# Altium schematic sheet NewPowerandPlaceSCH.SchDoc
size A0
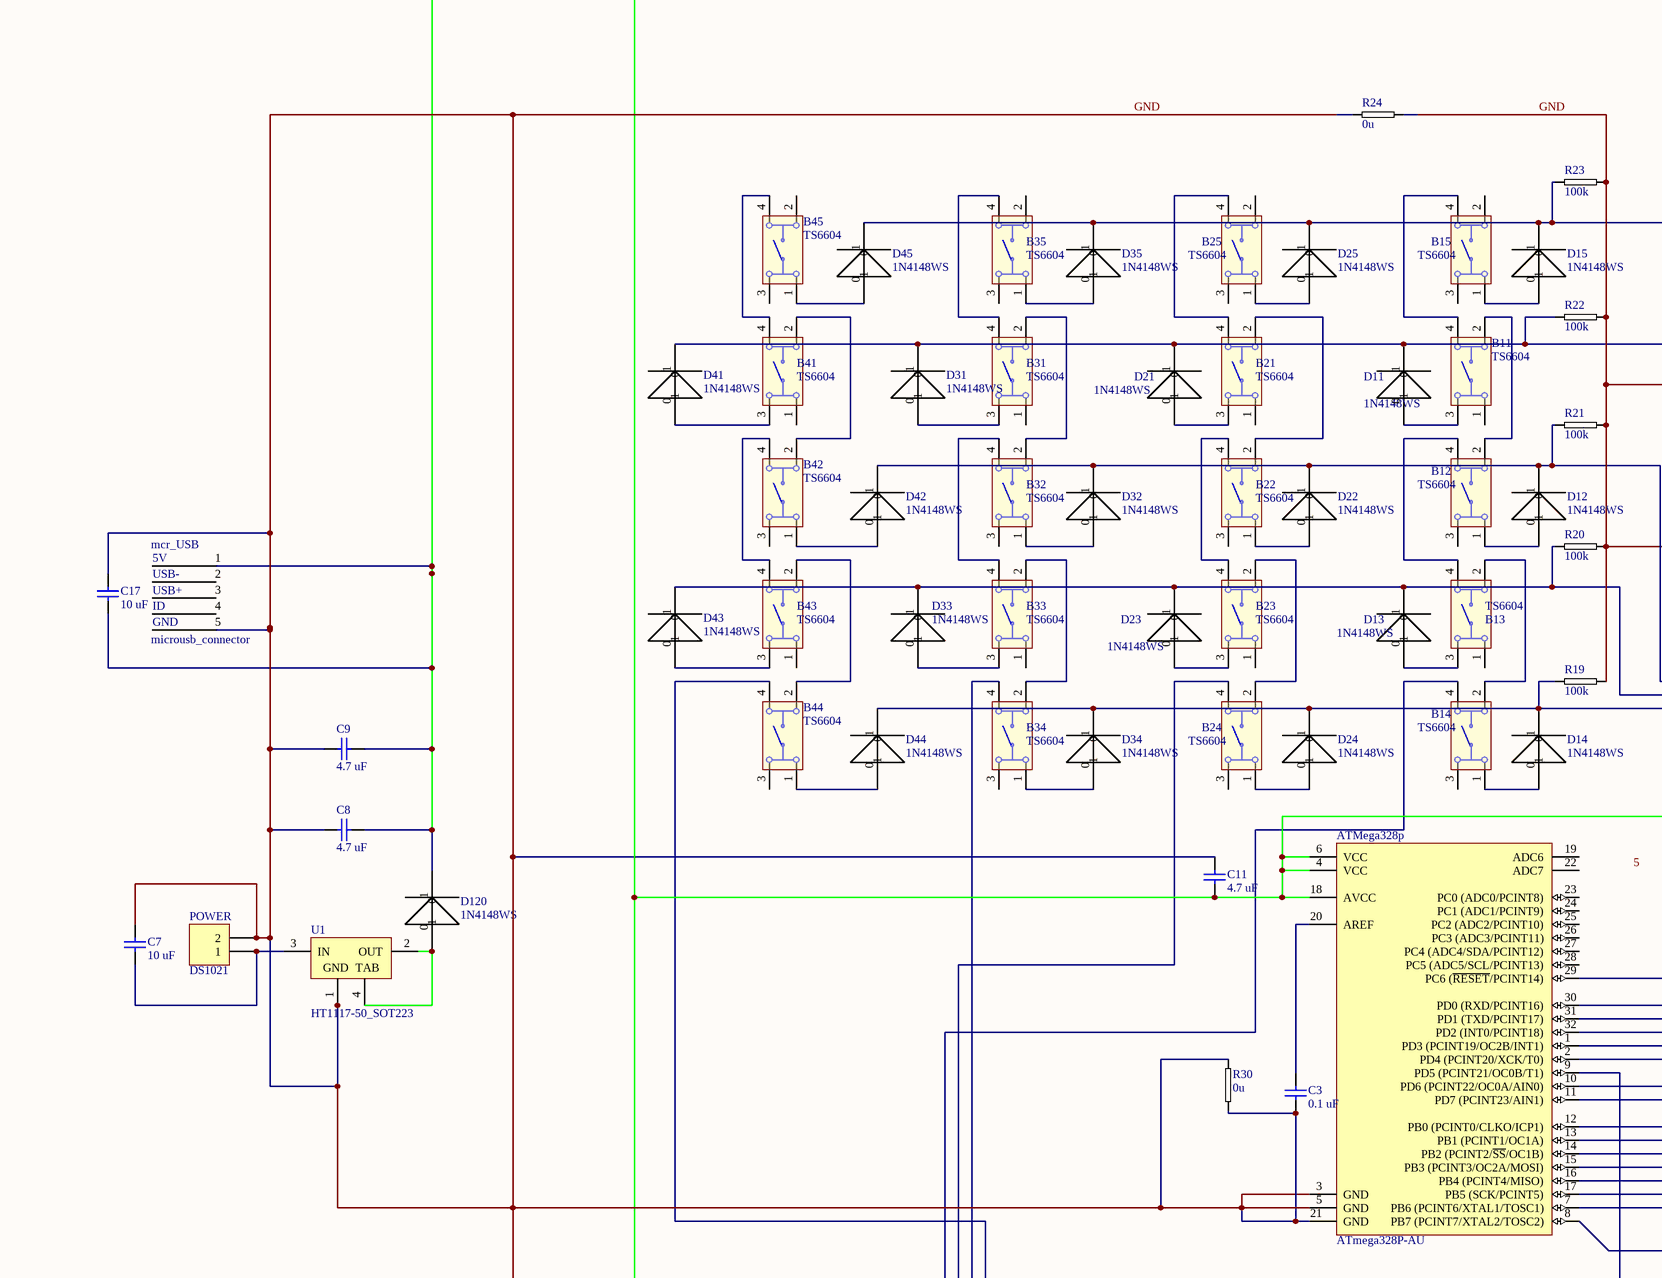
[diagram p0: NewPowerandPlaceSCH.SchDoc, top left]
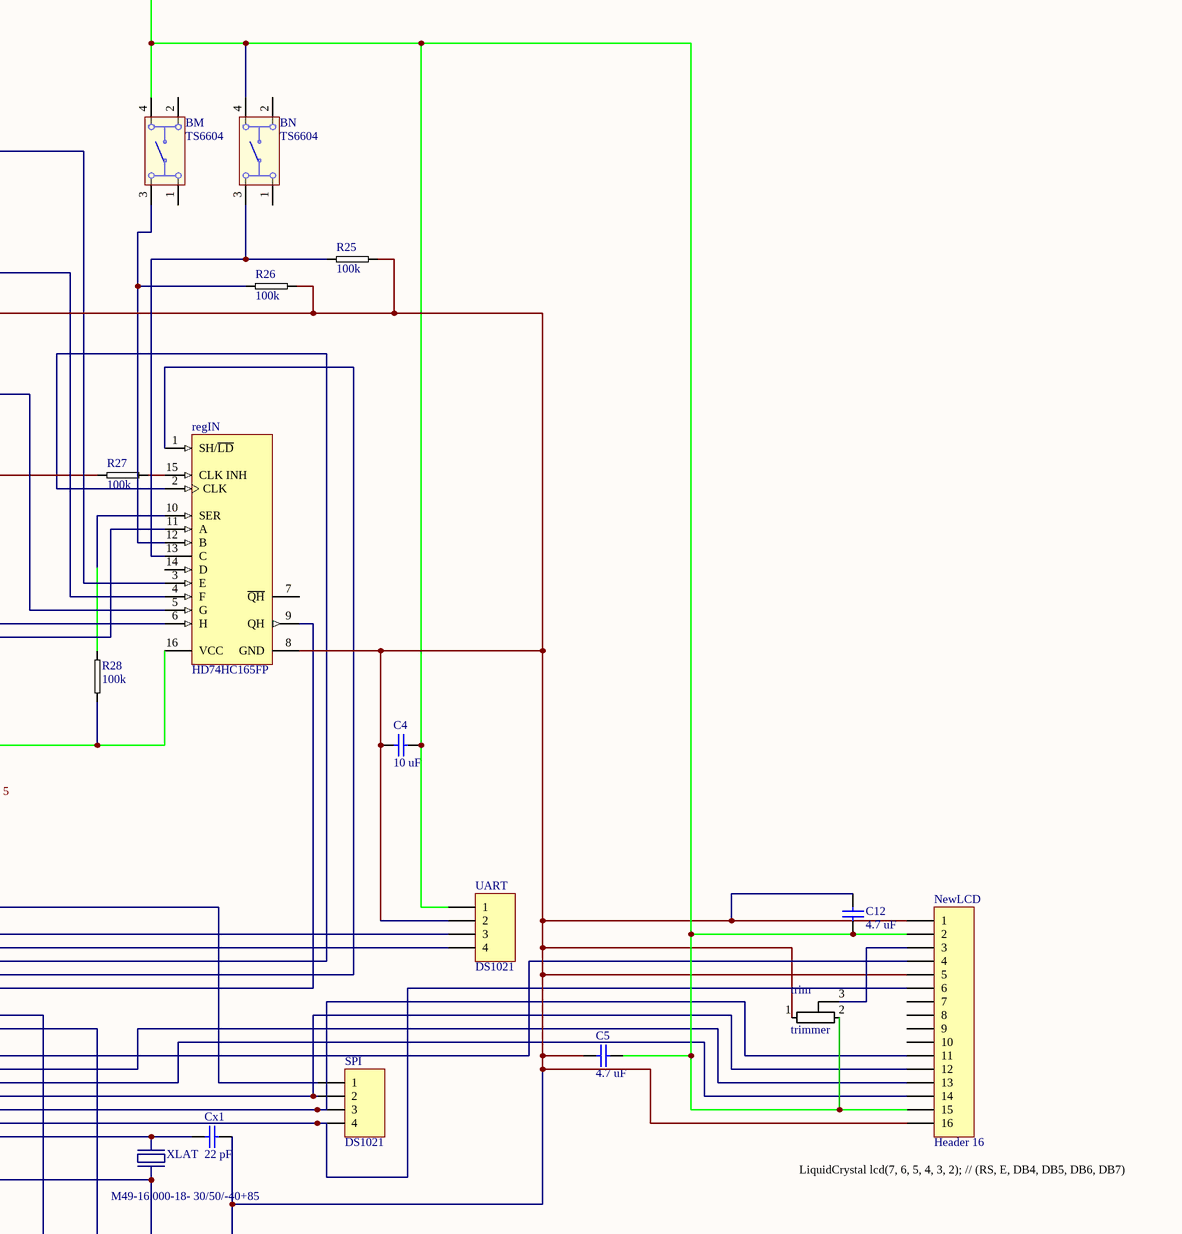
[diagram p1: NewPowerandPlaceSCH.SchDoc, top right]
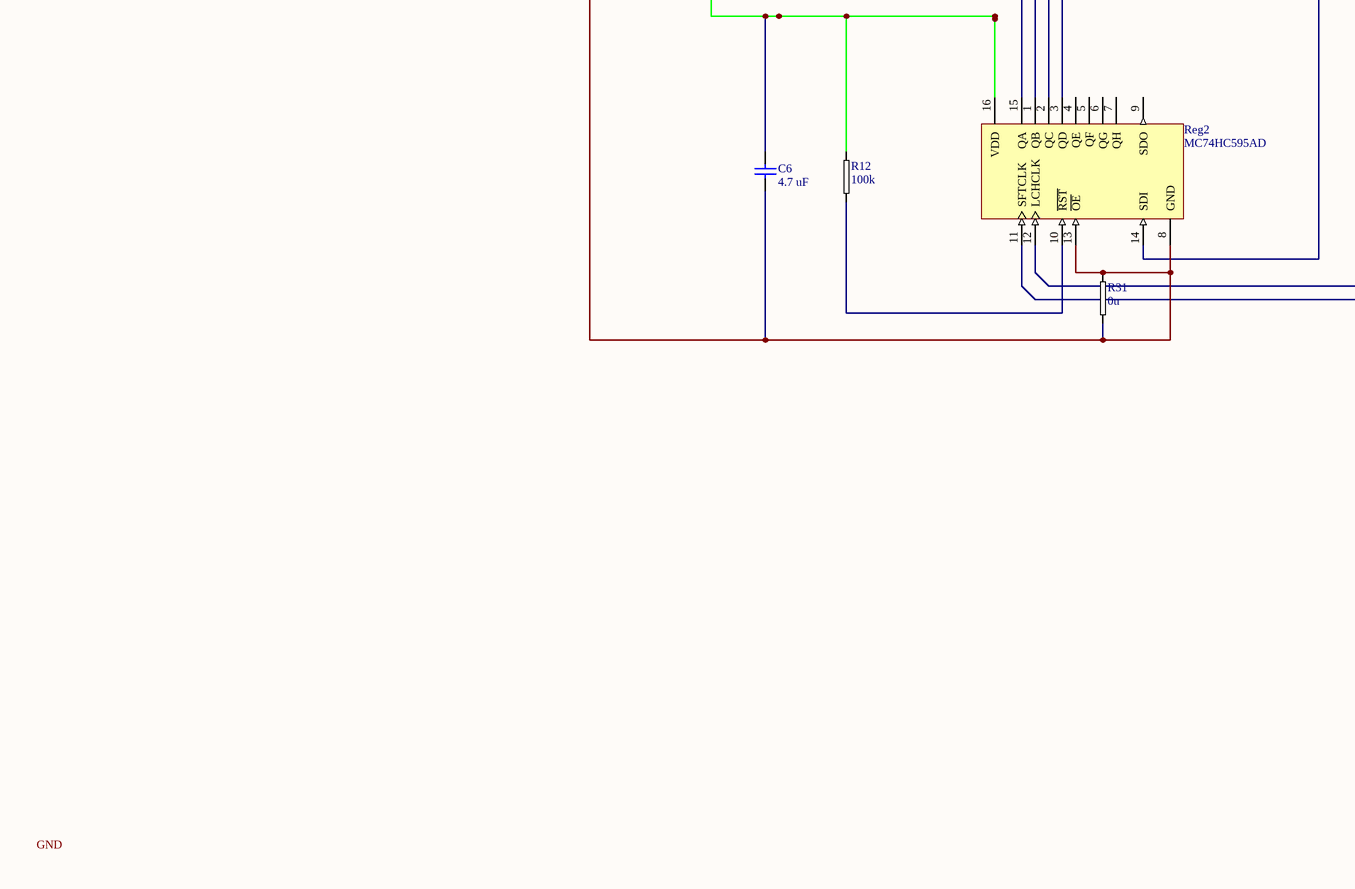
[diagram p2: NewPowerandPlaceSCH.SchDoc, bottom left]
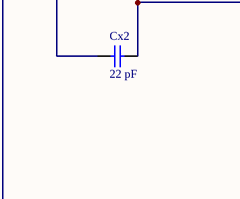
[diagram p3: NewPowerandPlaceSCH.SchDoc, bottom right]

## Parts
ATMega328p  ATmega328P-AU  [32A_N]
B11  TS6604  [430182070816]
B12  TS6604  [430182070816]
B13  TS6604  [430182070816]
B14  TS6604  [430182070816]
B15  TS6604  [430182070816]
B21  TS6604  [430182070816]
B22  TS6604  [430182070816]
B23  TS6604  [430182070816]
B24  TS6604  [430182070816]
B25  TS6604  [430182070816]
B31  TS6604  [430182070816]
B32  TS6604  [430182070816]
B33  TS6604  [430182070816]
B34  TS6604  [430182070816]
B35  TS6604  [430182070816]
B41  TS6604  [430182070816]
B42  TS6604  [430182070816]
B43  TS6604  [430182070816]
B44  TS6604  [430182070816]
B45  TS6604  [430182070816]
BM  TS6604  [430182070816]
BN  TS6604  [430182070816]
C3  0.1 uF  [0805]
C11  4.7 uF  [0805]
C12  4.7 uF  [0805]
C17  10 uF  [0805]
D11  1N4148WS  [sod323]
D12  1N4148WS  [sod323]
D13  1N4148WS  [sod323]
D14  1N4148WS  [sod323]
D15  1N4148WS  [sod323]
D21  1N4148WS  [sod323]
D22  1N4148WS  [sod323]
D23  1N4148WS  [sod323]
D24  1N4148WS  [sod323]
D25  1N4148WS  [sod323]
D31  1N4148WS  [sod323]
D32  1N4148WS  [sod323]
D33  1N4148WS  [sod323]
D34  1N4148WS  [sod323]
D35  1N4148WS  [sod323]
D41  1N4148WS  [sod323]
D42  1N4148WS  [sod323]
D43  1N4148WS  [sod323]
D44  1N4148WS  [sod323]
D45  1N4148WS  [sod323]
D120  1N4148WS  [sod323]
mcr_USB  microusb_connector  [USB_connector_2]
NewLCD  Header 16  [HDR1X16]
POWER  DS1021  [HDR1X2]
R12  100k  [res_0805]
R19  100k  [res_0805]
R20  100k  [res_0805]
R21  100k  [res_0805]
R22  100k  [res_0805]
R23  100k  [res_0805]
R24  0u  [res_0805]
R25  100k  [res_0805]
R26  100k  [res_0805]
R27  100k  [res_0805]
R28  100k  [res_0805]
R30  0u  [res_0805]
R31  0u  [res_0805]
Reg2  MC74HC595AD  [751B-05_N]
regIN  HD74HC165FP  [PRSP0016DH-B_N]
SPI  DS1021  [HDR1X4]
trim  trimmer  [trimmer_place]
U1  HT1117-50_SOT223  [SOT223_N]
UART  DS1021  [HDR1X4]
XLAT  M49-16.000-18- 30/50/-40+85  [cristal]
С4  10 uF  [0805]
С5  4.7 uF  [0805]
С6  4.7 uF  [0805]
С7  10 uF  [0805]
С8  4.7 uF  [0805]
С9  4.7 uF  [0805]
Сx1  22 pF  [res_0805]
Сx2  22 pF  [res_0805]

## Nets
GND: ATMega328p.3(GND) ATMega328p.5(GND) ATMega328p.21(GND) C3.2 C11.1 C12.2 C17.1 mcr_USB.5 NewLCD.1 NewLCD.5 NewLCD.16 POWER.2 R19.1 R20.1 R21.1 R22.1 R23.1 R24.0 R24.1 R25.1 R26.1 R27.0 R30.0 R30.1 R31.0 R31.1 Reg2.8(GND) Reg2.13(~{OE}) regIN.8(GND) trim.1 U1.1(GND) UART.2 С4.1 С5.1 С6.2 С7.1 С8.1 С9.1 Сx1.1 Сx2.1
NetATMega328p_1: ATMega328p.1(PD3_(PCINT19/OC2B/INT1)) regIN.1(SH/~{LD})
NetATMega328p_2: ATMega328p.2(PD4_(PCINT20/XCK/T0)) regIN.9(QH)
NetATMega328p_4: ATMega328p.4(VCC) ATMega328p.6(VCC) ATMega328p.18(AVCC) BM.4 BN.4 C11.2 C12.1 C17.2 D120.1 mcr_USB.1 NewLCD.2 NewLCD.15 R12.1 R28.0 Reg2.16(VDD) regIN.16(VCC) trim.2 UART.1 С4.2 С5.2 С6.1 С8.2 С9.2
NetATMega328p_7: ATMega328p.7(PB6_(PCINT6/XTAL1/TOSC1)) XLAT.1 Сx1.0
NetATMega328p_8: ATMega328p.8(PB7_(PCINT7/XTAL2/TOSC2)) XLAT.0 Сx2.0
NetATMega328p_9: ATMega328p.9(PD5_(PCINT21/OC0B/T1)) Reg2.14(SDI)
NetATMega328p_10: ATMega328p.10(PD6_(PCINT22/OC0A/AIN0)) Reg2.12(LCHCLK)
NetATMega328p_11: ATMega328p.11(PD7_(PCINT23/AIN1)) Reg2.11(SFTCLK)
NetATMega328p_12: ATMega328p.12(PB0_(PCINT0/CLKO/ICP1)) NewLCD.4
NetATMega328p_13: ATMega328p.13(PB1_(PCINT1/OC1A)) NewLCD.13
NetATMega328p_14: ATMega328p.14(PB2_(PCINT2/~{SS}/OC1B)) NewLCD.14
NetATMega328p_15: ATMega328p.15(PB3_(PCINT3/OC2A/MOSI)) NewLCD.12 SPI.2
NetATMega328p_16: ATMega328p.16(PB4_(PCINT4/MISO)) NewLCD.11 SPI.3
NetATMega328p_17: ATMega328p.17(PB5_(SCK/PCINT5)) NewLCD.6 SPI.4
NetATMega328p_20: ATMega328p.20(AREF) C3.1
NetATMega328p_29: ATMega328p.29(PC6_(~{RESET}/PCINT14)) SPI.1
NetATMega328p_30: ATMega328p.30(PD0_(RXD/PCINT16)) UART.3
NetATMega328p_31: ATMega328p.31(PD1_(TXD/PCINT17)) UART.4
NetATMega328p_32: ATMega328p.32(PD2_(INT0/PCINT18)) regIN.2(CLK)
NetB11_2: B11.2 B12.2
NetB11_3: B11.3 D11.0
NetB11_4: B11.4 B15.4
NetB12_1: B12.1 D12.0
NetB12_4: B12.4 B13.4
NetB13_2: B13.2 B14.2
NetB13_3: B13.3 D13.0
NetB14_1: B14.1 D14.0
NetB14_4: B14.4 Reg2.15(QA)
NetB15_1: B15.1 D15.0
NetB21_2: B21.2 B22.2
NetB21_3: B21.3 D21.0
NetB21_4: B21.4 B25.4
NetB22_1: B22.1 D22.0
NetB22_4: B22.4 B23.4
NetB23_2: B23.2 B24.2
NetB23_3: B23.3 D23.0
NetB24_1: B24.1 D24.0
NetB24_4: B24.4 Reg2.1(QB)
NetB25_1: B25.1 D25.0
NetB31_2: B31.2 B32.2
NetB31_3: B31.3 D31.0
NetB31_4: B31.4 B35.4
NetB32_1: B32.1 D32.0
NetB32_4: B32.4 B33.4
NetB33_2: B33.2 B34.2
NetB33_3: B33.3 D33.0
NetB34_1: B34.1 D34.0
NetB34_4: B34.4 Reg2.2(QC)
NetB35_1: B35.1 D35.0
NetB41_2: B41.2 B42.2
NetB41_3: B41.3 D41.0
NetB41_4: B41.4 B45.4
NetB42_1: B42.1 D42.0
NetB42_4: B42.4 B43.4
NetB43_2: B43.2 B44.2
NetB43_3: B43.3 D43.0
NetB44_1: B44.1 D44.0
NetB44_4: B44.4 Reg2.3(QD)
NetB45_1: B45.1 D45.0
NetBM_3: BM.3 R26.0 regIN.12(B)
NetBN_3: BN.3 R25.0 regIN.13(C)
NetD11_1: D11.1 D21.1 D31.1 D41.1 R22.0 regIN.4(F)
NetD12_1: D12.1 D22.1 D32.1 D42.1 R21.0 regIN.5(G)
NetD13_1: D13.1 D23.1 D33.1 D43.1 R20.0 regIN.6(H)
NetD14_1: D14.1 D24.1 D34.1 D44.1 R19.0 regIN.11(A)
NetD15_1: D15.1 D25.1 D35.1 D45.1 R23.0 regIN.3(E)
NetD120_0: D120.0 U1.2(OUT) U1.4(TAB)
NetNewLCD_3: NewLCD.3 trim.3
NetPOWER_1: POWER.1 U1.3(IN) С7.2
NetR12_0: R12.0 Reg2.10(~{RST})
NetR27_1: R27.1 regIN.15(CLK_INH)
NetR28_1: R28.1 regIN.10(SER)

Not connected (* = marked no-connect by the designer): ATMega328p 19(ADC6) 22(ADC7) 23(PC0_(ADC0/PCINT8)) 24(PC1_(ADC1/PCINT9)) 25(PC2_(ADC2/PCINT10)) 26(PC3_(ADC3/PCINT11)) 27(PC4_(ADC4/SDA/PCINT12)) 28(PC5_(ADC5/SCL/PCINT13)); B11 1; B12 3; B13 1; B14 3; B15 2 3; B21 1; B22 3; B23 1; B24 3; B25 2 3; B31 1; B32 3; B33 1; B34 3; B35 2 3; B41 1; B42 3; B43 1; B44 3; B45 2 3; BM 1 2; BN 1 2; mcr_USB 2 3 4; NewLCD 7 8 9 10; Reg2 4(QE) 5(QF) 6(QG) 7(QH) 9(SDO); regIN 7(~{QH}) 14(D)

## Notes on the sheet
- (near NewLCD) LiquidCrystal lcd(7, 6, 5, 4, 3, 2); // (RS, E, DB4, DB5, DB6, DB7)
- Labels drawn without touching a wire or pin: 5, GND
- (in symbol microusb_connector) 5V; USB-; USB+; ID; GND

## Library data of the parts
ATMega328p = ATmega328P-AU: 8-bit AVR Microcontroller, 32KB Flash, 1KB EEPROM, 2KB SRAM, 32-pin TQFP, Industrial Grade (-40°C to 85°C); DatasheetVersion: revD, May-2011; PackageVersion: revC, Oct-2010; PackageReference: 32A; PackageDescription: 32-Lead, 7x7x1.0 mm Body, 0.8mm Lead Pitch, Thin Profile Plastic Quad Flat Package (TQFP); Code_JEDEC: MS-026-ABA; ComponentLink1Description: Manufacturer URL; ComponentLink1URL: http://www.atmel.com/; ComponentLink2Description: ATmega48A/48PA/88A/88PA/168A/168PA/328/328P Datasheet; ComponentLink2URL: http://www.atmel.com/dyn/resources/prod_documents/doc8271.pdf; ComponentLink3Description: ATmega48A/48PA/88A/88PA/168A/168PA/328/328P Summary; ComponentLink3URL: http://www.atmel.com/dyn/resources/prod_documents/8271S.pdf
B11-B15 B21-B25 B31-B35 B41-B45 BM BN = 430182070816: WS-TASV SMD Tact Switch 6X6 mm; NoPins: 04; PackageReference: 430182070816; PartNumber: 430182070816; ComponentLink1Description: Manufacturer URL; ComponentLink1URL: http://www.we-online.com; ComponentLink2Description: Datasheet; ComponentLink2URL: http://katalog.we-online.de/em/datasheet/4301x2.pdf
C3 C11 C12 C17 С4-С9 Сx1 Сx2 = C0805: Ceramic Chip Capacitor - Standard; Note: Footprint corresponds to dimensions for bulk cassette packaging. This case size has tightened tolerances.; Published: 17-Jul-2002; LatestRevisionDate: 19-Mar-2004; LatestRevisionNote: Silkscreen size reduced.; DatasheetDocument: Mar-2001; PackageDocument: Mar-2001; PackageReference: 0805; Publisher: Altium Limited; Code_JEITA: 0805; Code_IPC: 2012[0805]; ComponentLink1Description: Manufacturer Link; ComponentLink1URL: http://www.kemet.com/; ComponentLink2Description: Datasheet; ComponentLink2URL: http://www.kemet.com/kemet/web/homepage/kechome.nsf/vapubfilesname/F3102TA.pdf/$file/F3102TA.pdf
D11-D15 D21-D25 D31-D35 D41-D45 D120 = SOD323
NewLCD = Header 16: Header, 16-Pin; LatestRevisionDate: 17-Jul-2002; LatestRevisionNote: Re-released for DXP Platform.; Publisher: Altium Limited
POWER = Header 2: Header, 2-Pin; LatestRevisionDate: 17-Jul-2002; LatestRevisionNote: Re-released for DXP Platform.; Publisher: Altium Limited
R12 R19-R28 R30 R31 = res_0805
Reg2 = MC74HC595AD: 8-Bit Serial-Input/Serial or Prallel-Output Shift Register with Latched 3-State Outputs; Published: 15-Apr-2002; LatestRevisionDate: 13-Apr-2006; LatestRevisionNote: IPC-7351 Footprint Added.; DatasheetVersion: Mar-2000; PackageVersion: Oct-1999; PackageReference: 751B-05; Publisher: Altium Limited; PackageDescription: 16-Pin Small Outline Integrated Circuit 1.27 mm Pitch; Code_JEDEC: MS-012-AC; Code_IPC: SOIC127P600-16; ComponentLink1Description: Manufacturer Link; ComponentLink1URL: http://www.onsemi.com/; ComponentLink2Description: Datasheet; ComponentLink2URL: http://www.onsemi.com/pub/Collateral/MC74HC595A-D.PDF
regIN = HD74HC165FP: Parallel-Load 8-bit Shift Register; Published: 10-Feb-2010; DatasheetVersion: Rev.3.00, Jan-2006; PackageVersion: Sep-2005; PackageReference: PRSP0016DH-B; Publisher: Altium Limited; PackageDescription: 16-Pin Plastic Small Outline Package 1.27 mm Pitch; Code_JEITA: P-SOP16-5.5x10.06-1.27; ComponentLink1Description: Manufacturer Link; ComponentLink1URL: http://sg.renesas.com/fmwk.jsp?cnt=hd74hc_root.jsp&fp=/products/standard_ic/general_purpose_logic/5v_standard_logic/hd74hc/; ComponentLink2Description: Datasheet; ComponentLink2URL: http://documentation.renesas.com/eng/products/logic/rej03d0581_hd74hc165ds.pdf; ComponentLink3Description: Packaging Specification; ComponentLink3URL: http://sg.renesas.com/media/products/common_info/package/pdf/ic/code/prsp0016dh_b.pdf
SPI UART = Header 4: Header, 4-Pin; LatestRevisionDate: 17-Jul-2002; LatestRevisionNote: Re-released for DXP Platform.; Publisher: Altium Limited
U1 = HT1117-50_SOT223: 5.0V, 1A General Purpose LDO; DatasheetVersion: rev1.10, Mar-2008; PackageVersion: 25/05/2010; PackageReference: SOT223; PackageDescription: 4-Pin SOT-223 Package, 6.5 x 3.5 mm Body, 2.3 mm Pitch, 7 mm Lead Span; ComponentLink1Description: Manufacturer URL; ComponentLink1URL: http://www.holtek.com/; ComponentLink2Description: Datasheet; ComponentLink2URL: http://www.holtek.com/pdf/consumer/1117v110.pdf; ComponentLink3Description: Package Specification; ComponentLink3URL: http://www.holtek.com/english/literature/package.pdf
XLAT = cristal_smd